# EAGLE design sensorboard (EAGLE 5.05)
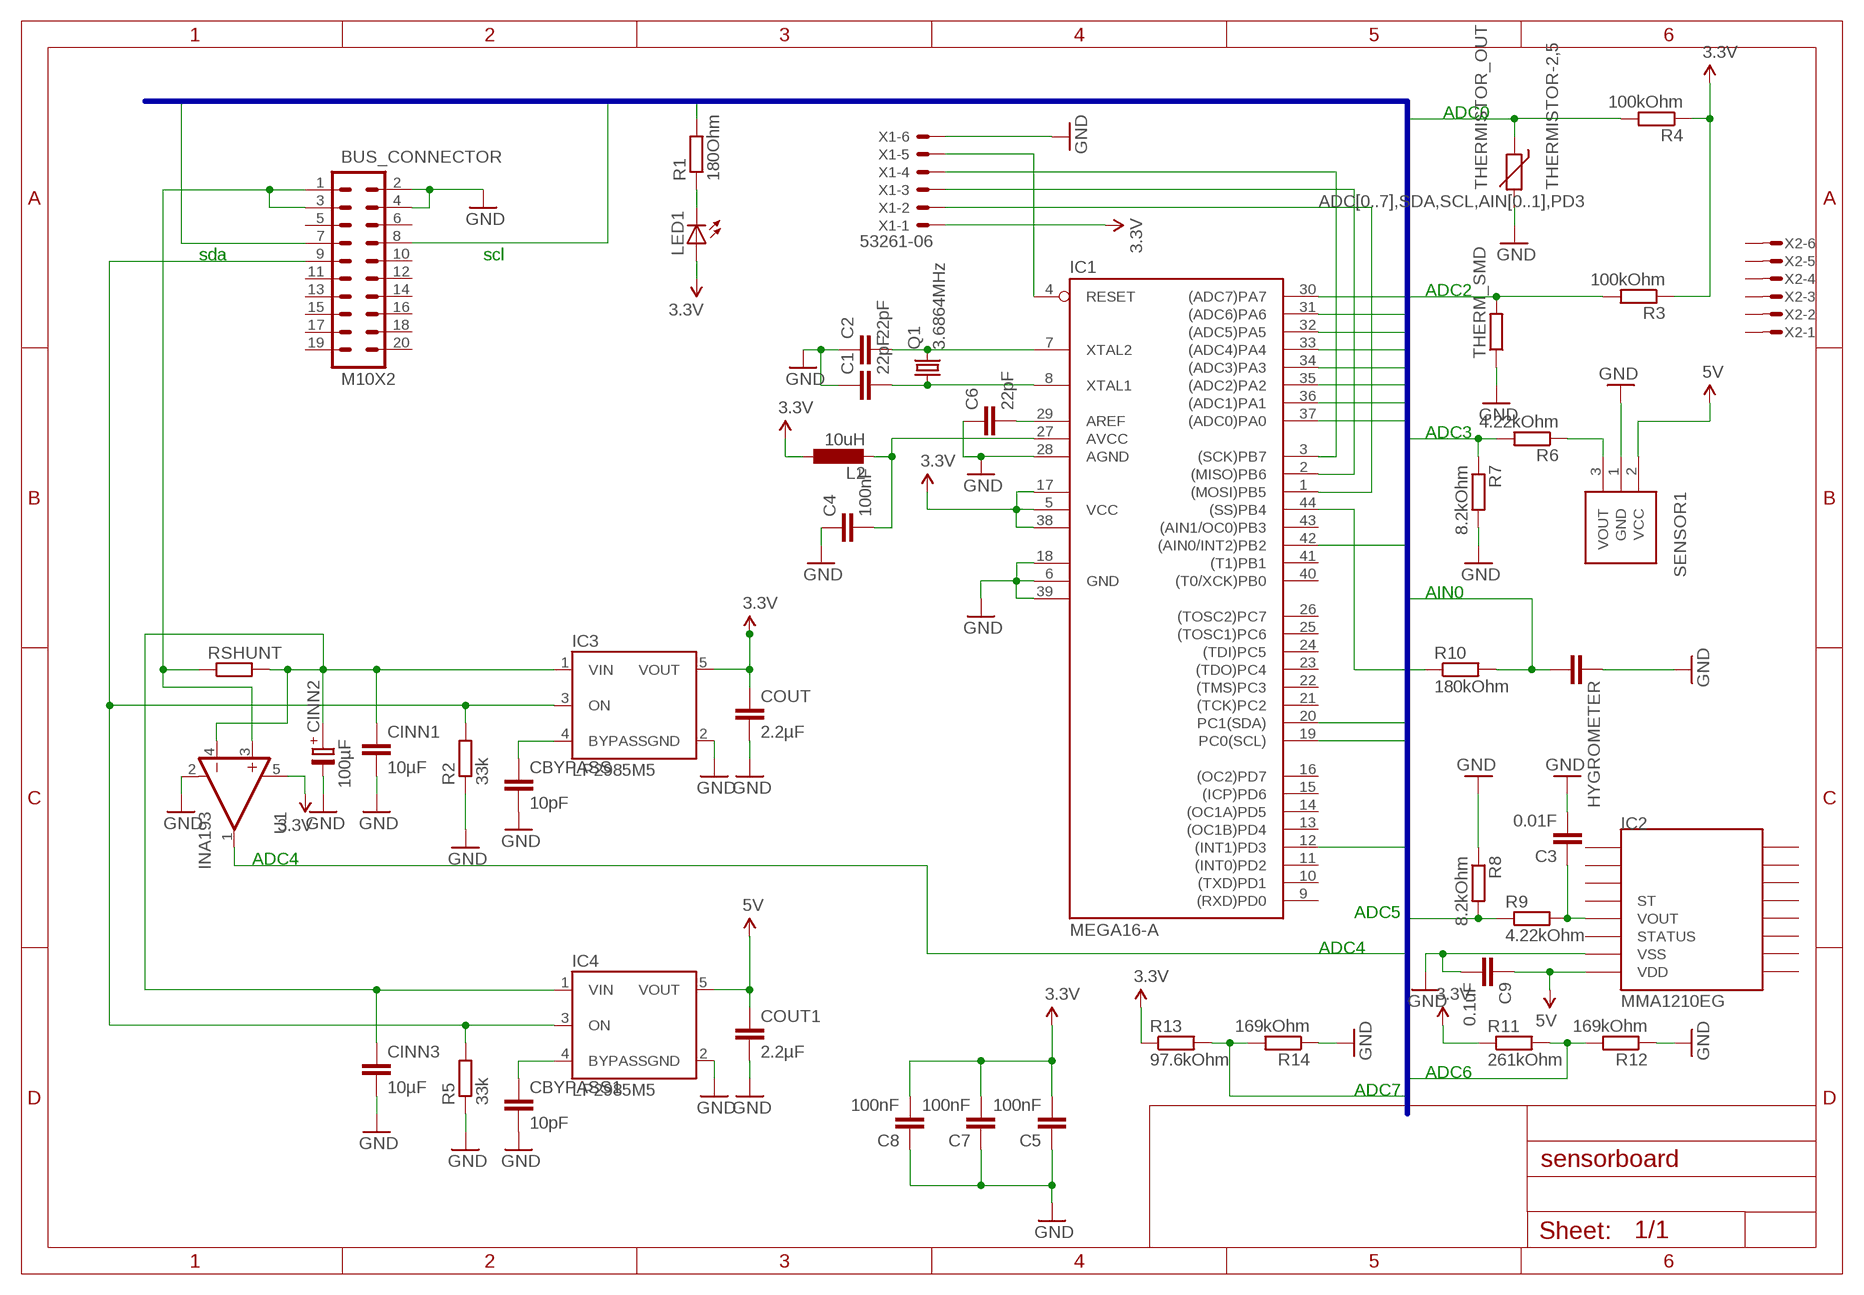
[diagram p0: schematic, sheet 1]

## Parts
BUS_CONNECTOR  M10X2  [2X10]
C1  22pF  C-EUC0805  [C0805]
C2  22pF  C-EUC0805  [C0805]
C3  0.01F  C-EUC0805  [C0805]
C4  100nF  C-EUC0805  [C0805]
C5  100nF  C-EUC0805  [C0805]
C6  22pF  C-EUC0805  [C0805]
C7  100nF  C-EUC0805  [C0805]
C8  100nF  C-EUC0805  [C0805]
C9  0.1uF  C-EUC0805  [C0805]
CBYPASS  10pF  C-EUC0805  [C0805]
CBYPASS1  10pF  C-EUC0805  [C0805]
CINN1  10µF  C-EUC0805  [C0805]
CINN2  100µF  C-PR-SMD-SV-C  [SV-C]
CINN3  10µF  C-EUC0805  [C0805]
COUT  2.2µF  C-EUC0805  [C0805]
COUT1  2.2µF  C-EUC0805  [C0805]
HYGROMETER  C-EU025-024X044  [C025-024X044]
IC1  MEGA16-A  [TQFP44]
IC2  MMA1210EG  [SOIC-16]
IC3  LP2985M5  [SOT23-5]
IC4  LP2985M5  [SOT23-5]
L2  10uH  INDUCTOR  [C0805]
LED1  LEDCHIPLED_0805  [CHIPLED_0805]
Q1  3.6864MHz  CRYSTALHC49UP  [HC49UP]
R1  180Ohm  R-EU_R0805  [R0805]
R2  33k  R-EU_R0805  [R0805]
R3  100kOhm  R-EU_R0805  [R0805]
R4  100kOhm  R-EU_R0805  [R0805]
R5  33k  R-EU_R0805  [R0805]
R6  4.22kOhm  R-EU_R0805  [R0805]
R7  8.2kOhm  R-EU_R0805  [R0805]
R8  8.2kOhm  R-EU_R0805  [R0805]
R9  4.22kOhm  R-EU_R0805  [R0805]
R10  180kOhm  R-EU_R0805  [R0805]
R11  261kOhm  R-EU_R0805  [R0805]
R12  169kOhm  R-EU_R0805  [R0805]
R13  97.6kOhm  R-EU_R0805  [R0805]
R14  169kOhm  R-EU_R0805  [R0805]
RSHUNT  R-EU_R0805  [R0805]
SENSOR1  MPX4105A  [3-PIN_TH]
THERM_SMD  R-EU_R0805  [R0805]
THERMISTOR_OUT  THERMISTOR-2,5  [RS-2,5]
U1  INA193  [SOT23-5]
X1  53261-06  [53261-06]
X2  MICROMATCH-6SM  [MMT-SMD-6]

## Nets
3.3V: C5.2 C7.2 C8.2 COUT.1 IC1.5(VCC) IC1.17(VCC1) IC1.38(VCC2) IC3.5(VOUT) L2.1 LED1.A R3.1 R4.1 R11.1 R13.1 U1.5(V+) X1.1
5V: C9.1 COUT1.1 IC2.VDD IC4.5(VOUT) SENSOR1.2(VCC)
ADC0: IC1.37((ADC0)PA0) R4.2 THERMISTOR_OUT.1
ADC1: IC1.36((ADC1)PA1)
ADC2: IC1.35((ADC2)PA2) R3.2 THERM_SMD.2
ADC3: IC1.34((ADC3)PA3) R6.2 R7.1
ADC4: IC1.33((ADC4)PA4) U1.1(OUT)
ADC5: IC1.32((ADC5)PA5) R8.2 R9.1
ADC6: IC1.31((ADC6)PA6) R11.2 R12.2
ADC7: IC1.30((ADC7)PA7) R13.2 R14.2
AIN0: HYGROMETER.2 IC1.42((AIN0/INT2)PB2) R10.2
GND: BUS_CONNECTOR.2 BUS_CONNECTOR.4 C1.1 C2.1 C3.2 C4.1 C5.1 C6.1 C7.1 C8.1 C9.2 CBYPASS1.2 CBYPASS.2 CINN1.2 CINN2.- CINN3.2 COUT1.2 COUT.2 HYGROMETER.1 IC1.6(GND) IC1.18(GND1) IC1.28(AGND) IC1.39(GND2) IC2.VSS IC3.2(GND) IC4.2(GND) R2.1 R5.1 R7.2 R8.1 R12.1 R14.1 SENSOR1.1(GND) THERM_SMD.1 THERMISTOR_OUT.2 U1.2(GND) X1.6
MISO: IC1.2((MISO)PB6) X1.3
MOSI: IC1.1((MOSI)PB5) X1.2
N$1: LED1.C R1.1
N$2: IC1.44((SS)PB4) R10.1
N$3: C6.2 IC1.29(AREF)
N$4: C1.2 IC1.8(XTAL1) Q1.1
N$5: C2.2 IC1.7(XTAL2) Q1.2
N$6: R6.1 SENSOR1.3(VOUT)
N$7: CBYPASS.1 IC3.4(BYPASS)
N$8: CINN1.1 CINN2.+ CINN3.1 IC3.1(VIN) IC4.1(VIN) RSHUNT.2 U1.4(VIN-)
N$9: C4.2 IC1.27(AVCC) L2.2
N$10: BUS_CONNECTOR.9 IC3.3(ON) IC4.3(ON) R2.2 R5.2
N$11: BUS_CONNECTOR.1 BUS_CONNECTOR.3 RSHUNT.1 U1.3(VIN+)
N$12: CBYPASS1.1 IC4.4(BYPASS)
N$13: C3.1 IC2.VOUT R9.2
PD3: IC1.12((INT1)PD3) R1.2
RST: IC1.4(RESET) X1.5
SCK: IC1.3((SCK)PB7) X1.4
SCL: BUS_CONNECTOR.8 IC1.19(PC0(SCL))
SDA: BUS_CONNECTOR.7 IC1.20(PC1(SDA))
Unconnected: BUS_CONNECTOR.5 BUS_CONNECTOR.6 BUS_CONNECTOR.10 BUS_CONNECTOR.11 BUS_CONNECTOR.12 BUS_CONNECTOR.13 BUS_CONNECTOR.14 BUS_CONNECTOR.15 BUS_CONNECTOR.16 BUS_CONNECTOR.17 BUS_CONNECTOR.18 BUS_CONNECTOR.19 BUS_CONNECTOR.20 IC1.9((RXD)PD0) IC1.10((TXD)PD1) IC1.11((INT0)PD2) IC1.13((OC1B)PD4) IC1.14((OC1A)PD5) IC1.15((ICP)PD6) IC1.16((OC2)PD7) IC1.21((TCK)PC2) IC1.22((TMS)PC3) IC1.23((TDO)PC4) IC1.24((TDI)PC5) IC1.25((TOSC1)PC6) IC1.26((TOSC2)PC7) IC1.40((T0/XCK)PB0) IC1.41((T1)PB1) IC1.43((AIN1/OC0)PB3) IC2.P$1 IC2.P$2 IC2.P$3 IC2.P$4 IC2.P$5 IC2.P$6 IC2.P$7 IC2.P$8 IC2.P$9 IC2.P$10 IC2.P$11 IC2.ST IC2.STATUS X2.1 X2.2 X2.3 X2.4 X2.5 X2.6

## Buses
ADC[0..7],SDA,SCL,AIN[0..1],PD3

## Notes on the sheet
- ADC0
- sda | scl
- ADC2
- ADC3
- AIN0
- ADC4
- ADC5
- ADC4
- ADC6
- ADC7

## Library data of the parts
BUS_CONNECTOR = SparkFunedit:M10X2: This was SPECIALLY designed to be used with our Graphic LCD Backpack. Be sure you want to use this! It is not only staggered on each line of header holes, but IT IS ALSO offset of the center point of the top and bottom lines by 5 mil. This causes the headers to lock into place on the "standard" footprint on the LCD screen. The extra squares on the tdocu layer are there simply to reference other pins (if you were to actually populate a longer header than ten long - this is what we do with the backpacks).
C1-C9 HYGROMETER = resistor:C-EU: CAPACITOR, European symbol
CBYPASS CBYPASS1 CINN1 CINN3 COUT COUT1 = rcl:C-EU: CAPACITOR, European symbol
CINN2 = cap-pan40:C-PR: POLARIZED ELECTROLYTIC/TANTALUM
IC1 = avr-5:MEGA16: MICROCONTROLLER 16 Kbytes FLASH 1 kbytes SRAM 512 bytes EEPROM USART 8-channel 10 bit ADC
IC2 = cansat:MMA1210EG
IC3 IC4 = v-reg-3:LP2985: National Semiconductor <http://www.national.com> Micropower Linear Regulator 150mA regulated output, Vin 16V max., ultra-low dropout of 300mV @ 150mA, 1µA standby current, low noise
L2 = cansat:INDUCTOR
LED1 = led:LED: LED OSRAM: - CHIPLED LG R971, LG N971, LY N971, LG Q971, LY Q971, LO R971, LY R971 LH N974, LH R974 LS Q976, LO Q976, LY Q976 LO Q996 - Hyper CHIPLED LW Q18S LB Q993, LB Q99A, LB R99A - SideLED LS A670, LO A670, LY A670, LG A670, LP A670 LB A673, LV A673, LT A673, LW A673 LH A674 LY A675 LS A676, LA A676, LO A676, LY A676, LW A676 LS A679, LY A679, LG A679 - Hyper Micro SIDELED® LS Y876, LA Y876, LO Y876, LY Y876 LT Y87S - SmartLED LW L88C, LW L88S LB L89C, LB L89S, LG L890 LS L89K, LO L89K, LY L89K LS L896, LA L896, LO L896, LY L896 - TOPLED LS T670, LO T670, LY T670, LG T670, LP T670 LSG T670, LSP T670, LSY T670, LOP T670, LYG T670 LG T671, LOG T671, LSG T671 LB T673, LV T673, LT T673, LW T673 LH T674 LS T676, LA T676, LO T676, LY T676, LB T676, LH T676, LSB T676, LW T676 LB T67C, LV T67C, LT T67C, LS T67K, LO T67K, LY T67K, LW E67C LS E67B, LA E67B, LO E67B, LY E67B, LB E67C, LV E67C, LT E67C LW T67C LS T679, LY T679, LG T679 LS T770, LO T770, LY T770, LG T770, LP T770 LB T773, LV T773, LT T773, LW T773 LH T774 LS E675, LA E675, LY E675, LS T675 LS T776, LA T776, LO T776, LY T776, LB T776 LHGB T686 LT T68C, LB T68C - Hyper Mini TOPLED® LB M676 - Mini TOPLED Santana® LG M470 LS M47K, LO M47K, LY M47K Source: http://www.osram.convergy.de LUXEON: - LUMILED® LXK2-PW12-R00, LXK2-PW12-S00, LXK2-PW14-U00, LXK2-PW14-V00 LXK2-PM12-R00, LXK2-PM12-S00, LXK2-PM14-U00 LXK2-PE12-Q00, LXK2-PE12-R00, LXK2-PE12-S00, LXK2-PE14-T00, LXK2-PE14-U00 LXK2-PB12-K00, LXK2-PB12-L00, LXK2-PB12-M00, LXK2-PB14-N00, LXK2-PB14-P00, LXK2-PB14-Q00 LXK2-PR12-L00, LXK2-PR12-M00, LXK2-PR14-Q00, LXK2-PR14-R00 LXK2-PD12-Q00, LXK2-PD12-R00, LXK2-PD12-S00 LXK2-PH12-R00, LXK2-PH12-S00 LXK2-PL12-P00, LXK2-PL12-Q00, LXK2-PL12-R00 Source: www.luxeon.com KINGBRIGHT: KA-3528ASYC Source: www.kingbright.com
Q1 = crystal:CRYSTAL: CRYSTAL
R1 R3 R4 R6-R14 THERM_SMD = resistor:R-EU_: RESISTOR, European symbol
R2 R5 RSHUNT = rcl:R-EU_: RESISTOR, European symbol
SENSOR1 = cansat:MPX4105A
THERMISTOR_OUT = varistor:THERMISTOR: THERMISTOR
U1 = burr-brown:INA193
X1 = con-molex:53?-06: CONNECTOR wire to board 1.25 mm (.049 inch) pitch header
X2 = con-amp-micromatch:MICROMATCH-6: MicroMaTch 6 7-215464-6 / 0-215464-6 Drawing Number C-215464 DDEController.pdf

## Board
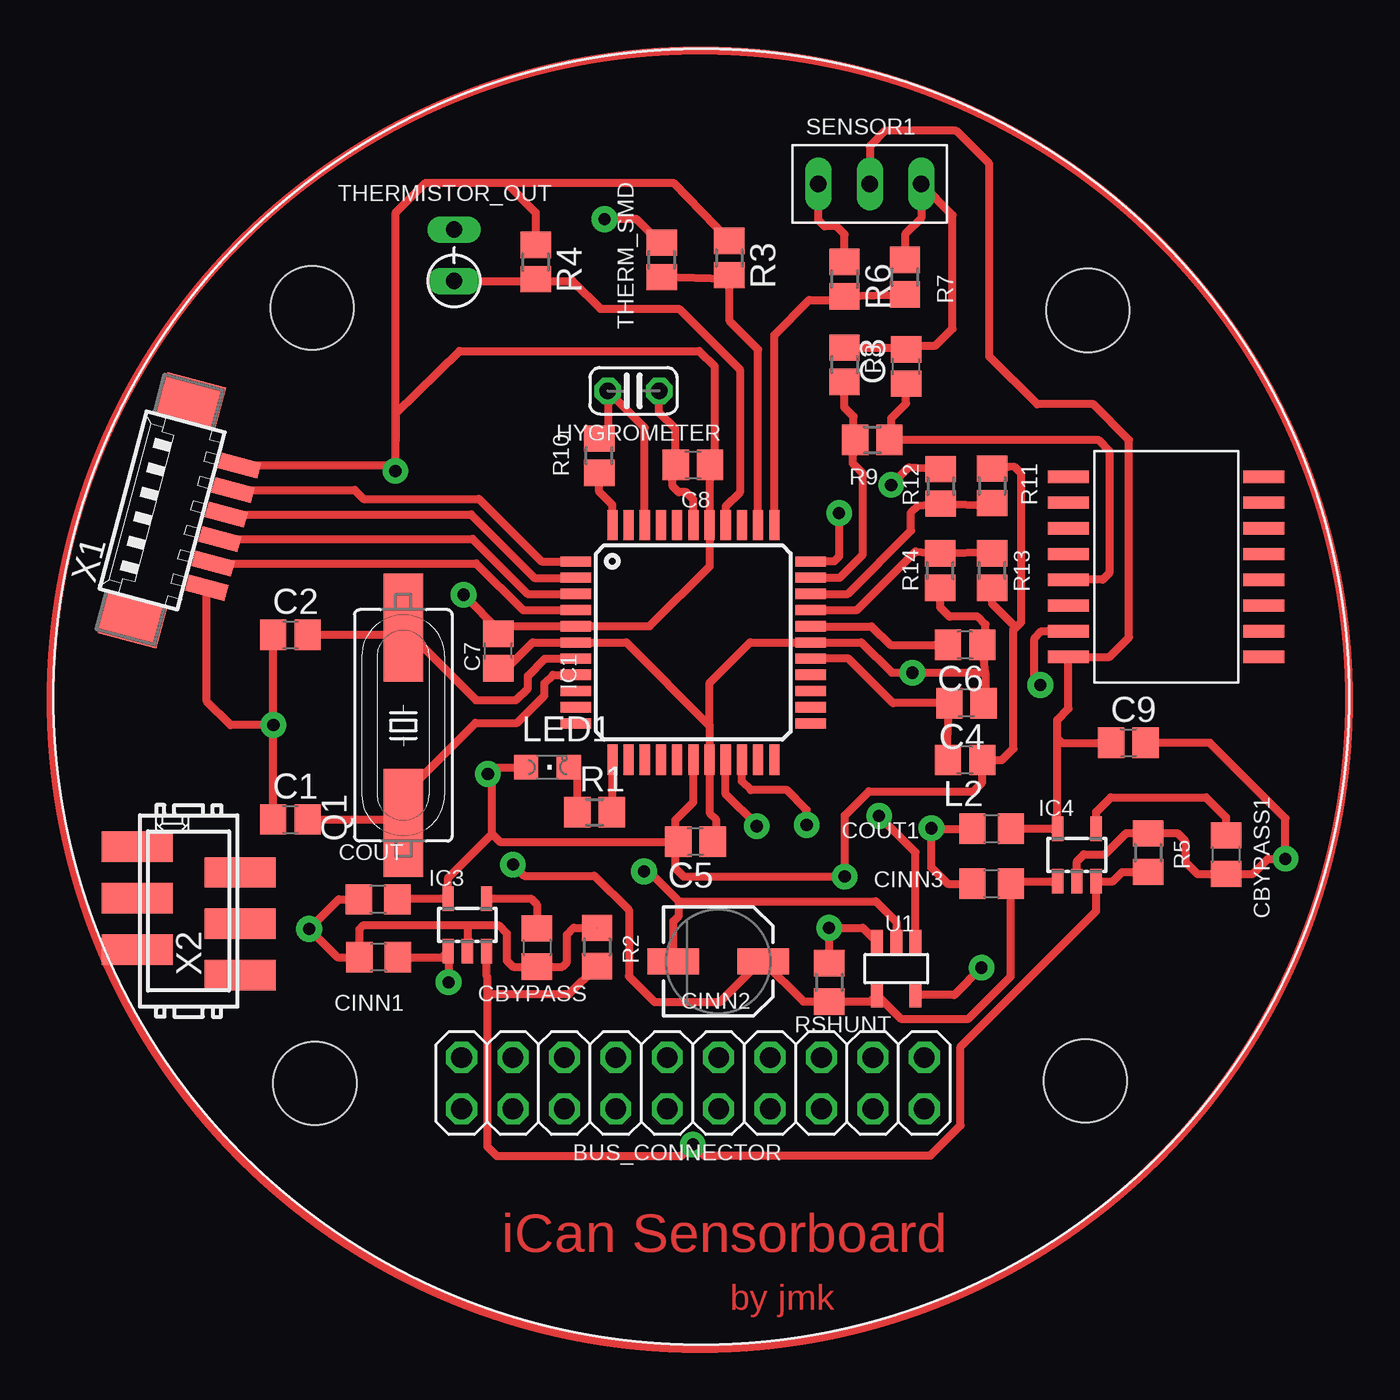
[diagram p1: board, top side]
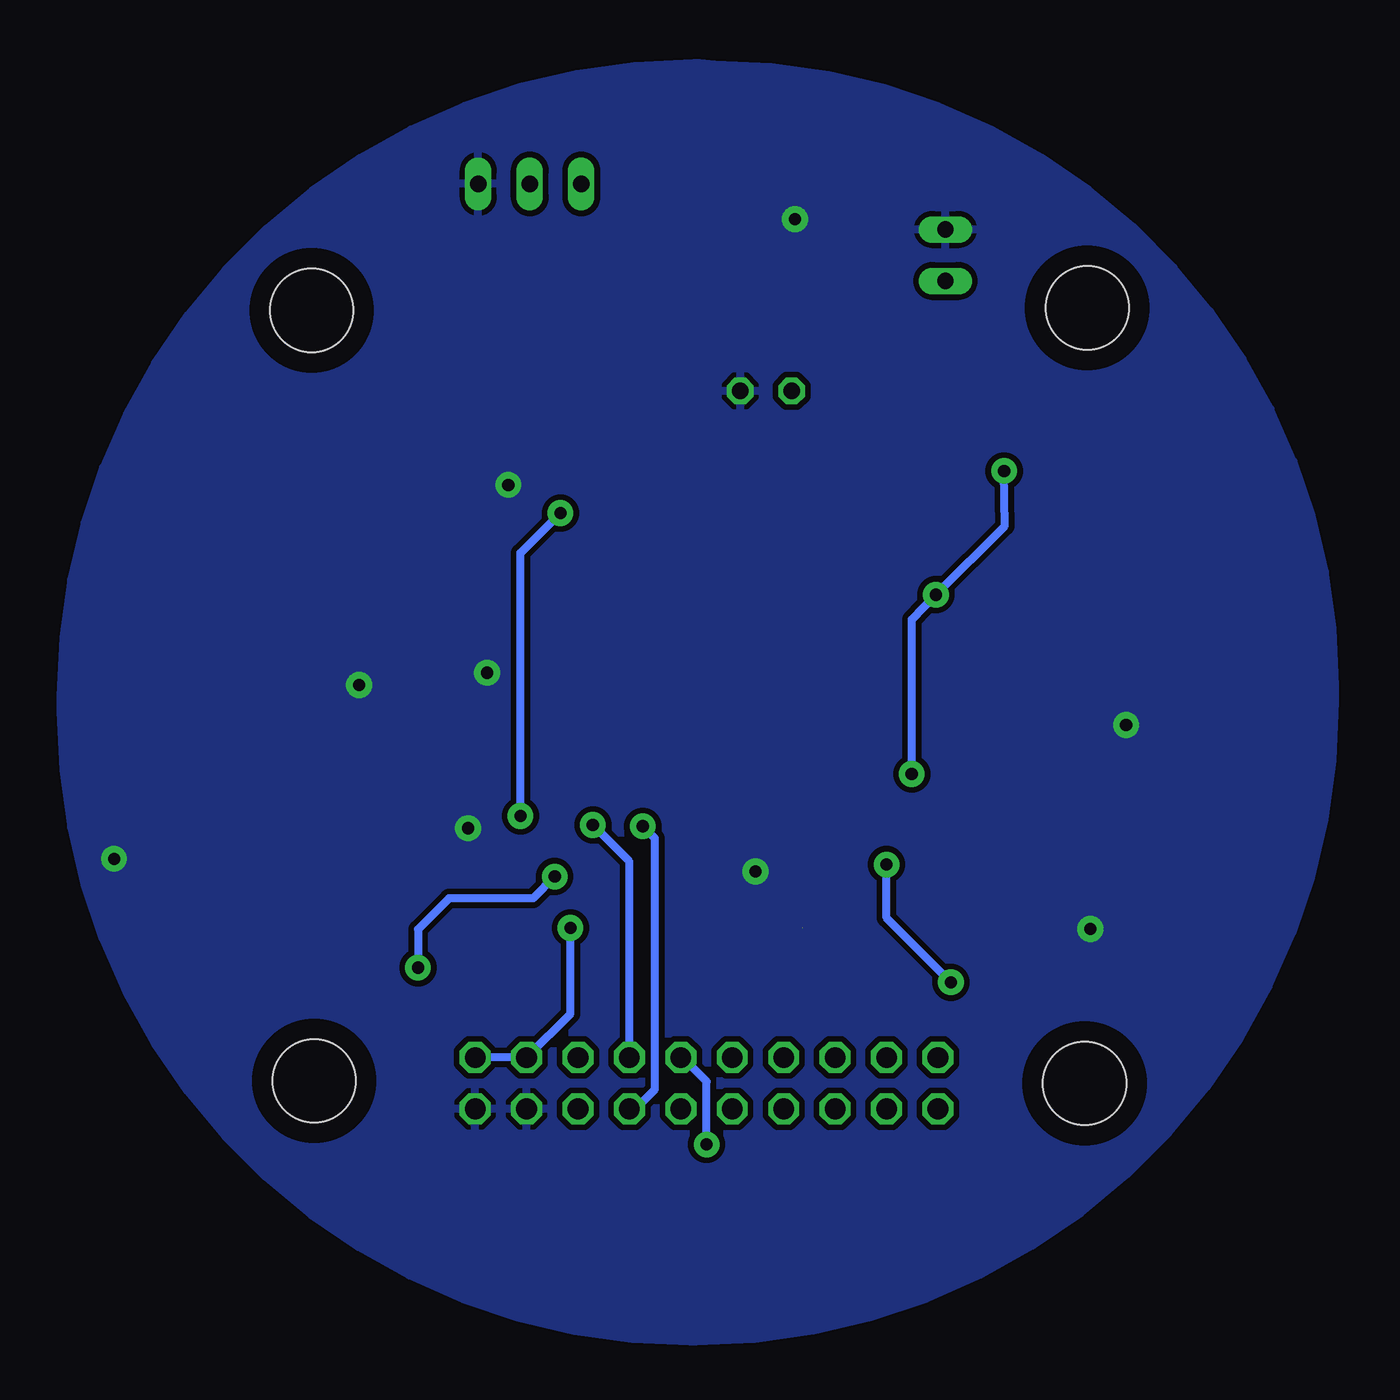
[diagram p2: board, bottom side, seen from below]

No outline drawn. Coordinates in mm, seen from the top.
Copper layers (1*16): Top 0.035mm / dielectric 1.5mm / Bottom 0.035mm
Design rules "default *": minimum track width 10mil, minimum drill 0.0152mm, track to track 11mil, track to pad 11mil, pad to pad 11mil, via to via 11mil, smd to smd 11mil, copper to edge 40mil, drill to drill 8mil, minimum pad ring 10mil, minimum via ring 8mil, stop-mask expansion 4mil, vias tented up to drill 0mil, thermal gap 10mil

### Footprints (pad centres in the part's own frame; a part is rotated, then mirrored left to right if it is on the bottom)
2X10 = drill 1.016 octagon: 1 -11.013,-7.687; 2 -11.013,-5.147; 3 -8.473,-7.687; 4 -8.473,-5.147; 5 -5.933,-7.687; 6 -5.933,-5.147; 7 -3.393,-7.687; 8 -3.393,-5.147; 9 -0.853,-7.687; 10 -0.853,-5.147; 11 1.687,-7.687; 12 1.687,-5.147; 13 4.227,-7.687; 14 4.227,-5.147; 15 6.767,-7.687; 16 6.767,-5.147; 17 9.307,-7.687; 18 9.307,-5.147; 19 11.847,-7.687; 20 11.847,-5.147 | hole 4.1: 19.093,-6.407; 19.22,-44.715; -19.087,-44.591; -18.964,-6.533
C0805 = smd 1.3 x 1.5: 1 -0.85,0; 2 0.85,0
C0805' = smd 1.3 x 1.5: 1 -0.95,0; 2 0.95,0
SV-C = smd 2.54 x 1.27: + -2.223,0; - 2.223,0
C025-024X044 = drill 0.813 octagon: 1 -1.27,0; 2 1.27,0
TQFP44 = smd 1.5 x 0.5: 1 -5.8,4; 2 -5.8,3.2; 3 -5.8,2.4; 4 -5.8,1.6; 5 -5.8,0.8; 6 -5.8,0; 7 -5.8,-0.8; 8 -5.8,-1.6; 9 -5.8,-2.4; 10 -5.8,-3.2; 11 -5.8,-4; 23 5.8,-4; 24 5.8,-3.2; 25 5.8,-2.4; 26 5.8,-1.6; 27 5.8,-0.8; 28 5.8,0; 29 5.8,0.8; 30 5.8,1.6; 31 5.8,2.4; 32 5.8,3.2; 33 5.8,4 | smd 0.5 x 1.5: 12 -4,-5.8; 13 -3.2,-5.8; 14 -2.4,-5.8; 15 -1.6,-5.8; 16 -0.8,-5.8; 17 0,-5.8; 18 0.8,-5.8; 19 1.6,-5.8; 20 2.4,-5.8; 21 3.2,-5.8; 22 4,-5.8; 34 4,5.8; 35 3.2,5.8; 36 2.4,5.8; 37 1.6,5.8; 38 0.8,5.8; 39 0,5.8; 40 -0.8,5.8; 41 -1.6,5.8; 42 -2.4,5.8; 43 -3.2,5.8; 44 -4,5.8
SOIC-16 = smd 0.61 x 2.03: P$1 -2.54,2.54; P$2 -1.27,2.54; P$3 0,2.54; P$4 1.27,2.54; P$5 2.54,2.54; P$6 3.81,2.54; P$7 5.08,2.54; P$8 6.35,2.54; P$9 -2.54,-7.11; P$10 -1.27,-7.11; P$11 0,-7.11; ST 1.27,-7.11; STATUS 3.81,-7.11; VDD 6.35,-7.11; VOUT 2.54,-7.11; VSS 5.08,-7.11
SOT23-5 = smd 0.55 x 1.2: 1 -0.95,-1.3; 2 0,-1.3; 3 0.95,-1.3; 4 0.95,1.3; 5 -0.95,1.3
CHIPLED_0805 = smd 1.2 x 1.2: A 0,-1.05; C 0,1.05
HC49UP = smd 5.334 x 1.93: 1 -4.826,0; 2 4.826,0
R0805 = smd 1.3 x 1.5: 1 -0.85,0; 2 0.85,0
R0805' = smd 1.3 x 1.5: 1 -0.95,0; 2 0.95,0
3-PIN_TH = drill 0.813 long: 1 2.54,0; 2 0,0; 3 -2.54,0
RS-2,5 = drill 0.813 long: 1 -1.27,0; 2 1.27,0
SOT23-5' = smd 0.6 x 1.2: 1 -0.95,-1.306; 2 0,-1.306; 3 0.95,-1.306; 4 0.95,1.306; 5 -0.95,1.306
53261-06 = smd 0.8 x 2: 1 3.125,-2.5; 2 1.875,-2.5; 3 0.625,-2.5; 4 -0.625,-2.5; 5 -1.875,-2.5; 6 -3.125,-2.5 | smd 2.1 x 3: S1 5.625,0.625; S2 -5.625,0.625
MMT-SMD-6 = smd 1.5 x 3.5: 1 3.175,2.54; 2 1.905,-2.54; 3 0.635,2.54; 4 -0.635,-2.54; 5 -1.905,2.54; 6 -3.175,-2.54

### Placement (x,y rotation side)
BUS_CONNECTOR  48.26,12.7 180 top
C1  27.96,32.15 0 top
C2  27.96,41.27 0 top
C3  58.37,54.52 90 top
C4  61.36,37.89 180 top
C5  47.97,31.05 180 top
C6  61.29,40.76 180 top
C7  38.23,40.47 90 top
C8  47.84,49.66 0 top
C9  69.35,35.93 0 top
CBYPASS  10pF  [C0805']  40.14,25.81 270 top
CBYPASS1  10pF  [C0805']  74.17,30.41 270 top
CINN1  10µF  [C0805']  32.32,25.34 180 top
CINN2  49.09,25.13 180 top
CINN3  10µF  [C0805']  62.6,28.96 180 top
COUT  2.2µF  [C0805']  32.28,28.19 180 top
COUT1  2.2µF  [C0805']  62.6,31.68 180 top
HYGROMETER  44.91,53.31 180 top
IC1  47.86,40.89 0 top
IC2  73.51,46.52 270 top
IC3  36.7,26.93 0 top
IC4  66.81,30.39 0 top
L2  61.29,35.08 180 top
LED1  40.65,34.72 270 top
Q1  33.54,36.79 90 top
R1  42.99,32.5 0 top
R2  33k  [R0805']  43.1,25.84 270 top
R3  49.64,59.88 270 top
R4  40.07,59.68 270 top
R5  33k  [R0805']  70.33,30.5 270 top
R6  55.33,58.83 270 top
R7  58.32,58.94 90 top
R8  55.33,54.6 270 top
R9  56.7,50.9 0 top
R10  43.21,50.11 90 top
R11  62.62,48.62 270 top
R12  60.09,48.6 270 top
R13  62.62,44.45 90 top
R14  60.06,44.43 90 top
RSHUNT  [R0805']  54.57,24.1 270 top
SENSOR1  56.58,63.54 0 top
THERM_SMD  46.29,59.79 270 top
THERMISTOR_OUT  36.04,60.01 90 top
U1  INA193  [SOT23-5']  57.89,24.78 180 top
X1  22.22,47.25 75 top
X2  22.93,27.62 90 top

### Tracks (layer width: path | path; a pad name or v marks a point on that pad's centre or on a via)
3.3V  (via drill 0.6 pad 1.27)
  Top 0.406: COUT.1 33.27,28.23 IC3.5 35.75,29.26 37.92,31.43 | IC1.38 48.67,49.66 C8.2 | IC1.17 47.86,33 46.97,32.11 46.97,31.05 C5.2 46.97,31.04 | U1.5 60.75,23.47 v62.1,24.82 | 63.68,41.5 63.68,35.65 63.1,35.07 L2.1 62.14,33.97 61.7,33.53 56.53,33.53 55.34,32.34 v55.34,29.32 47.39,29.32 46.97,29.74 46.97,31.04 | 63.68,41.5 63.65,41.5 | R13.1 62.63,43.48 62.63,42.79 63.8,41.62 | R11.1 63.72,49.57 64.06,49.23 64.06,41.89 63.8,41.62 | 63.68,41.5 63.8,41.62 | C8.2 48.66,49.48 | 37.92,31.43 37.92,34.18 v37.71,34.4 38.03,34.72 LED1.A | v36.51,43.25 38.31,41.42 C7.2 38.8,41.69 IC1.5 45.71,41.69 48.68,44.66 48.68,46.67 | 37.14,63.6 34.64,63.6 33.16,62.12 33.16,52.39 v33.14,49.36 | 37.14,63.6 38,63.6 | R3.1 46.87,63.6 38.6,63.6 | 37.14,63.6 38.6,63.6 | C8.2 48.91,49.73 48.91,54.53 48.15,55.29 36.3,55.29 33.17,52.22 v33.14,49.36 | 46.97,31.04 38.31,31.04 37.92,31.43 | R4.1 40.07,62.13 38.6,63.6 | X1.1 32.88,49.62 v33.14,49.36
  Bottom 0.406: v62.1,24.82 62.1,26.72 60.57,28.25 56.41,28.25 v55.34,29.32 | v37.71,34.4 37.71,42.03 v36.51,43.25 33.11,46.64 v33.14,49.36
5V
  Top 0.406: COUT1.1 63.55,31.69 IC4.5 65.84,31.71 65.84,36.15 | 65.84,36.15 65.84,37.06 66.4,37.62 IC2.VDD 68.42,40.17 69.39,41.14 69.39,50.89 67.63,52.65 64.85,52.65 62.48,55.01 62.48,64.53 60.85,66.16 57.34,66.16 56.58,65.4 SENSOR1.2 | C9.1 66.06,35.93 65.84,36.15
ADC0
  Top 0.406: THERMISTOR_OUT.1 40.06,58.74 R4.2 40.09,58.74 41.9,58.74 43.27,57.37 47.15,57.37 50.16,54.37 50.16,48.3 49.46,47.6 IC1.37
ADC2
  Top 0.406: IC1.35 51.06,55.36 49.65,56.77 49.65,58.92 R3.2 49.54,58.84 THERM_SMD.2
ADC3
  Top 0.406: IC1.34 51.86,56.08 53.58,57.8 55.24,57.8 R6.2 55.43,57.99 R7.1
ADC4  (via drill 0.6 pad 1.27)
  Top 0.406: U1.1 58.84,30.52 v57.04,32.32 | v55.06,47.28 55.06,45.14 54.82,44.89 IC1.33
  Bottom 0.406: v57.04,32.32 57.04,45.31 v55.06,47.28
ADC5
  Top 0.406: IC1.32 55.1,44.09 56.24,45.23 56.24,49.24 55.74,49.73 55.74,50.89 R9.1 55.77,50.92 55.77,52.05 55.33,52.5 R8.2
ADC6
  Top 0.406: IC1.31 55.49,43.28 58.62,46.41 58.62,47.32 58.95,47.65 R12.2 62.6,47.65 R11.2
ADC7
  Top 0.406: IC1.30 55.95,42.49 58.84,45.38 R14.2 62.61,45.38 R13.2
AIN0
  Top 0.406: R10.2 43.64,51.39 HYGROMETER.2 45.46,51.49 IC1.42
GND  (via drill 0.6 pad 1.27)  (1 unrouted)
  Top 0.406: v77.11,30.2 76.24,30.2 75.49,29.45 CBYPASS1.2 | CBYPASS1.2 | THERM_SMD.1 46.11,60.73 45.05,61.8 v43.47,61.8 | 48.67,36.77 44.55,40.89 IC1.6 39.93,40.89 38.51,39.47 C7.1 | 48.67,36.77 IC1.18 48.66,32.47 48.97,32.16 48.97,31.05 C5.1 | IC4.2 66.81,30.08 67.15,30.42 68.19,30.42 69.24,31.47 70.32,31.47 R5.1 70.34,31.47 71.77,31.47 72.16,31.08 72.16,30.06 72.77,29.45 CBYPASS1.2 | v28.89,26.74 30.29,25.34 CINN1.2 31.37,26.72 31.58,26.93 36.68,26.93 36.7,26.91 | v28.89,26.74 29.06,26.74 | v28.89,26.74 28.91,26.71 | COUT1.2 59.65,31.68 v59.62,31.71 59.62,29.77 60.43,28.96 CINN3.2 | R7.2 58.32,61.05 59.12,61.85 SENSOR1.1 60.66,62 60.66,56.39 59.83,55.55 58.34,55.55 C3.2 58.3,55.45 R8.1 | U1.2 57.89,27.09 56.88,28.1 47.14,28.1 | CINN2.- 46.88,27.11 47.14,27.38 47.14,28.1 | 48.67,36.77 48.67,38.89 50.67,40.89 IC1.28 56.16,40.89 57.66,39.39 v58.69,39.39 62.27,39.39 62.29,39.37 | 62.29,39.37 62.29,37.96 C4.1 | 62.29,39.37 C6.1 62.3,40.78 62.3,41.78 61.92,42.16 60.52,42.16 60.06,42.62 R14.1 | IC1.39 47.86,47.95 47.5,48.31 47.13,48.31 46.84,48.6 46.84,49.65 C8.1 46.98,49.66 46.98,51.45 46.18,52.24 HYGROMETER.1 | 36.7,26.91 IC3.2 | 36.7,26.91 36.69,26.92 38.23,26.92 38.64,26.52 38.64,25.17 38.95,24.86 CBYPASS.2 41.4,24.86 41.62,25.09 41.62,26.45 41.96,26.79 R2.1 | C9.2 73.38,35.93 77.11,32.2 v77.11,30.2 | v77.11,30.2 | COUT.2 30.34,28.19 v28.89,26.74 | 45.85,29.57 v45.42,29.57 45.67,29.57 47.14,28.1 | R12.1 58.52,49.55 v57.64,48.67 | IC2.VSS 65.07,41.44 64.71,41.09 64.71,39.07 v65,38.78 | X1.6 23.83,37.98 25,36.81 v27.12,36.81 | C2.1 27.11,36.82 v27.12,36.81 | C1.1 27.11,36.79 v27.12,36.81
  pour Bottom: 48.16,69.5 48.51,69.5 arc-90 79.76,38.24 79.76,37.47 arc-90 48.66,6.36 48.38,6.36 arc-90 16.77,37.96 16.77,38.74 arc-90 47.46,69.43
MISO
  Top 0.406: X1.3 36.89,47.21 40.02,44.08 42.05,44.08 IC1.2
MOSI
  Top 0.406: X1.2 31.14,48.41 31.57,47.98 37.27,47.98 40.36,44.89 IC1.1
N$1
  Top 0.406: R1.1 42.14,34.29 LED1.C
N$2
  Top 0.406: IC1.44 43.86,47.68 43.2,48.34 43.2,49.16 R10.1
N$3
  Top 0.406: C6.2 57.59,40.76 56.67,41.68 IC1.29
N$4
  Top 0.406: C1.2 33.36,32.15 Q1.1 33.4,32.11 33.4,33.21 37.1,36.91 39.16,36.91 40.51,38.26 40.51,38.87 40.92,39.29 IC1.8
N$5
  Top 0.406: C2.2 33.2,41.27 Q1.2 37.12,38.03 39.1,38.03 39.69,38.62 39.69,39.24 40.53,40.09 IC1.7
N$6
  Top 0.406: R6.1 55.33,61.05 54.93,61.45 54.34,61.45 54.04,61.75 SENSOR1.3
N$7
  Top 0.406: IC3.4 39.84,28.23 40.14,27.94 CBYPASS.1
N$8  (via drill 0.6 pad 1.27)
  Top 0.406: IC4.1 63.68,29.09 CINN3.1 63.55,24.39 61.46,22.3 58.11,22.3 U1.4 56.62,23.15 RSHUNT.2 53.29,23.15 CINN2.+ 51.18,25.13 49.17,23.12 45.95,23.12 44.68,24.4 44.68,27.66 42.98,29.36 39.5,29.36 v38.95,29.91 | CINN1.1 35.45,25.34 IC3.1 35.77,25.61 v35.77,24.1
  Bottom 0.406: v38.95,29.91 38.95,27.28 v35.77,24.1
N$9
  Top 0.406: L2.2 60.36,35.16 C4.2 60.35,37.89 57.73,37.89 55.53,40.09 IC1.27
N$10  (via drill 0.6 pad 1.27)
  Top 0.406: R5.2 69.05,29.55 68.59,29.09 IC4.3 67.76,27.61 61.06,20.92 61.06,17.03 59.58,15.54 48.38,15.54 v47.84,16.09 47.27,15.52 38.15,15.52 37.7,15.98 37.7,23.52 | 37.7,23.52 37.7,24.35 37.65,24.4 IC3.3 | R2.2 41.73,23.52 37.7,23.52
  Bottom 0.406: 47.8,16.12 v47.84,16.09 47.84,19.2 49.02,20.39 BUS_CONNECTOR.9
N$11  (via drill 0.6 pad 1.27)
  Top 0.406: RSHUNT.1 v54.57,26.79 56.24,26.79 U1.3
  Bottom 0.406: v54.57,26.79 54.57,22.55 BUS_CONNECTOR.3 BUS_CONNECTOR.1
N$12
  Top 0.406: IC4.4 67.76,32.52 68.48,33.24 73.18,33.24 74.17,32.24 CBYPASS1.1
N$13
  Top 0.406: C3.1 58.37,52.69 57.65,51.97 57.65,50.91 R9.2 67.86,50.9 68.41,50.35 68.41,44.31 68.09,43.98 IC2.VOUT | IC2.VOUT
PD3
  Top 0.406: IC1.12 43.86,32.53 R1.2
RST
  Top 0.406: X1.5 37.14,44.79 39.45,42.48 IC1.4
SCK
  Top 0.406: X1.4 36.97,46 39.67,43.29 IC1.3
SCL  (via drill 0.6 pad 1.27)
  Top 0.406: v50.99,31.81 50.99,31.86 49.46,33.4 IC1.19
  Bottom 0.406: BUS_CONNECTOR.8 51.36,17.85 50.4,18.81 50.4,31.21 v50.99,31.81
SDA  (via drill 0.6 pad 1.27)
  Top 0.406: v53.46,31.87 53.46,32.62 52.49,33.59 50.7,33.59 50.26,34.03 IC1.20
  Bottom 0.406: BUS_CONNECTOR.7 51.65,30.06 v53.46,31.87
(copper drawn outside any net)
  shapes: Top circle x1

### Text on the board
Top: iCan Sensorboard | by jmk